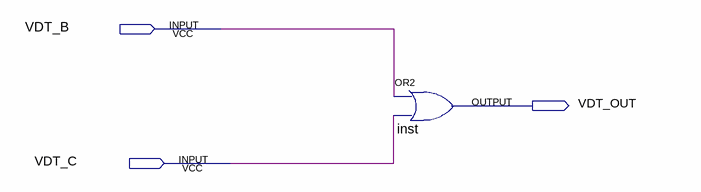
[diagram p0: schematic sheet]
// Quartus schematic assignment2c.bdf as structural Verilog: 1 symbols, 3 pins
module assignment2c (
  input  VDT_B,
  input  VDT_C,
  output VDT_OUT
);

  or inst (VDT_OUT, VDT_B, VDT_C);
endmodule
